# EasyEDA Pro project 2dof-experiment-system.eprj, schematic Schematic3
Create Date: 2025-05-08; Page Name: P1; Project Name: 2dof-experiment-system; Schematic Name: Schematic3; Update Date: 2025-05-08; Company: 嘉立创EDA; Page Size: A4; Version: V1.0
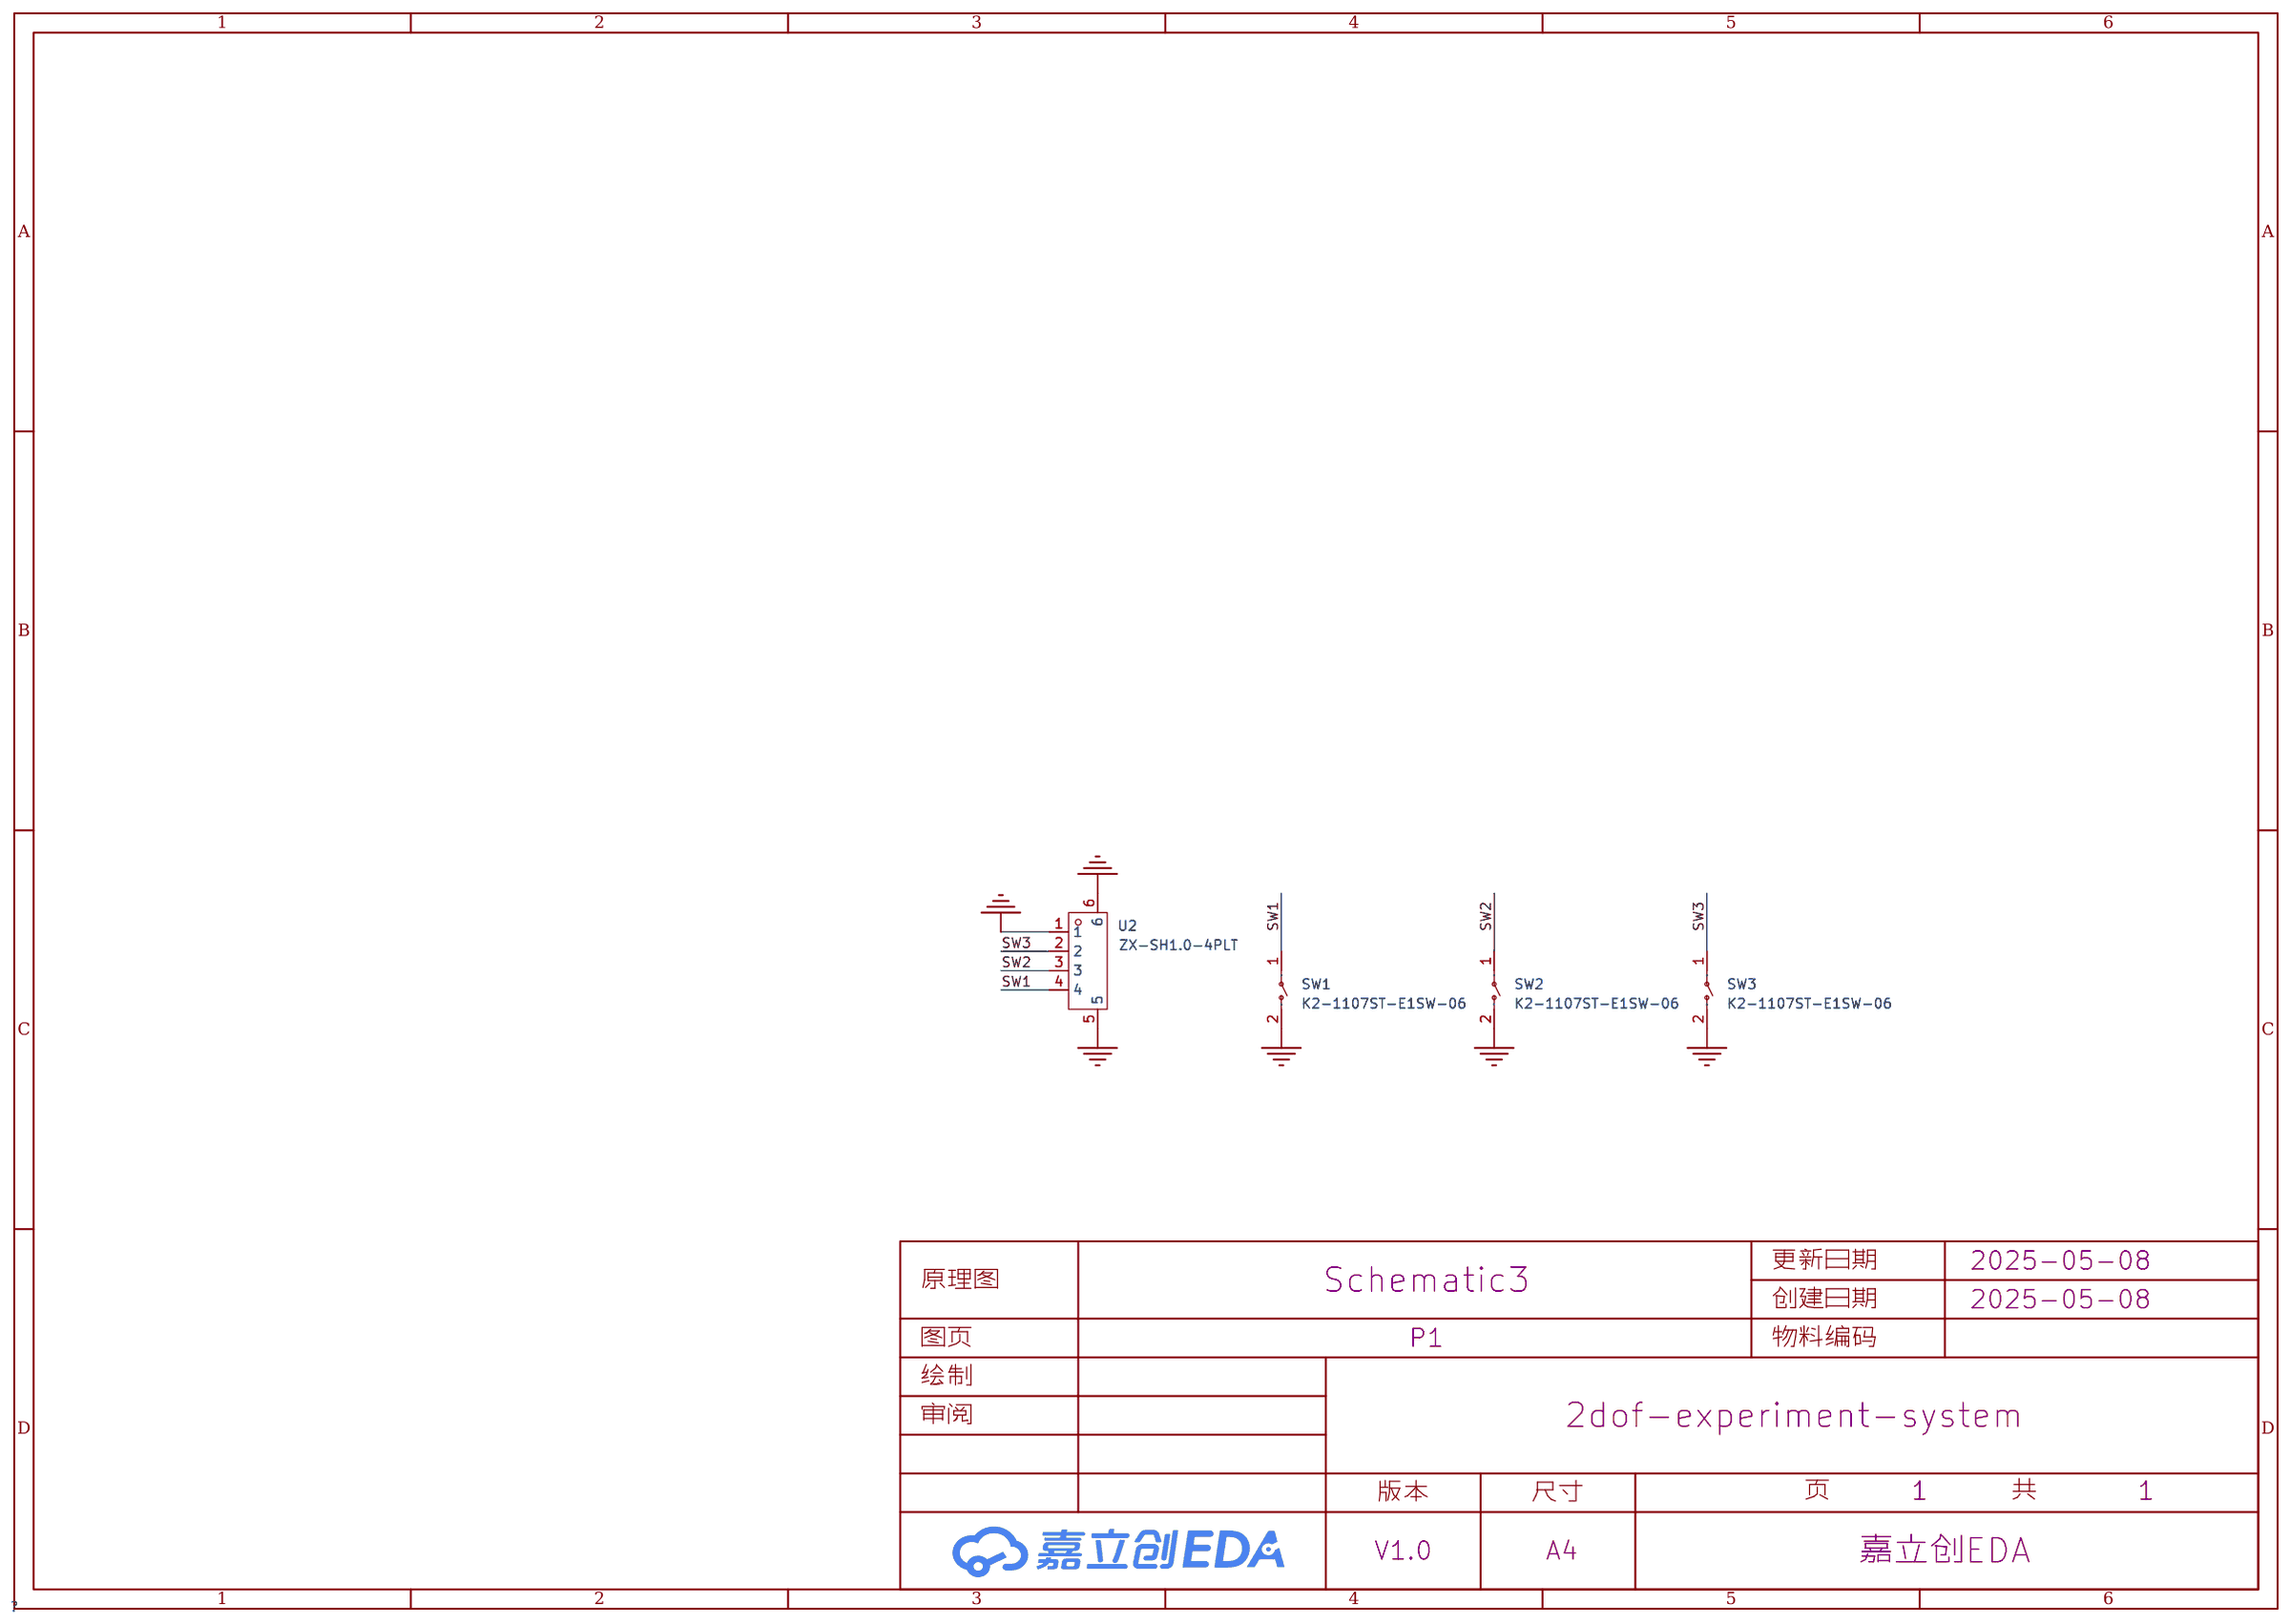
[diagram p2: schematic sheet]

## Parts
SW1  K2-1107ST-E1SW-06  [SW-SMD_L6.0-W3.6-LS8.0]
SW2  K2-1107ST-E1SW-06  [SW-SMD_L6.0-W3.6-LS8.0]
SW3  K2-1107ST-E1SW-06  [SW-SMD_L6.0-W3.6-LS8.0]
U2  ZX-SH1.0-4PLT  [CONN-SMD_4P-P1.00_ZX-SH1.0-4PLN]

## Library data of the parts
SW1-SW3 = K2-1107ST-E1SW-06: 作用力:90gf;安装方式:立贴;开关长度:6.1mm;开关宽度:3.6mm;开关高度:2.5mm;触点电流:50mA;额定电压(DC):12V;绝缘电阻:100MΩ;机械寿命:10万次;; LCSC Part Name: 362.5 进口弹片 有防水膜 灰胶头100G; Supplier Part: C707329; Manufacturer: 韩国韩荣; Supplier Footprint: SMD; JLCPCB Part Class: 扩展库; Datasheet: https://atta.szlcsc.com/upload/public/pdf/source/20210810/381712CEF248770C072B585C3485C888.pdf; Supplier: LCSC; Operating Force: 90gf; Mounting Style: 立贴; Switch Length: 6.1mm; Switch Width: 3.6mm; Switch Height: 2.5mm; Contact Current: 50mA; Voltage Rating (DC): 12V; Insulation Resistance: 100MΩ; Mechanical Life: 10万次; Operating Temperature: -25℃~+85℃
U2 = ZX-SH1.0-4PLT: 插针结构:1x4P;间距:1mm;安装方式:立贴;参考系列:SH;总PIN数:4P;排数:1;每排PIN数:4;行距:-;额定电流:-;触头材质:黄铜;触头镀层:锡;工作温度范围:-;; LCSC Part Name: 1x4P 间距:1mm 立贴 系列:SH; Supplier Part: C7430453; Manufacturer: Megastar(兆星); Supplier Footprint: SMD,P=1mm; JLCPCB Part Class: 扩展库; Datasheet: https://atta.szlcsc.com/upload/public/pdf/source/20230619/835F7171C111E992D22DF3E9A54627DE.pdf; Supplier: LCSC; Pins Structure: 1x4P; Pitch: 1mm; Mounting Style: 立贴; Reference Series: SH; Number of Pins: 4P; Number of Rows: 1; Number of PINs Per Row: 4; Contact Material: 黄铜; Contact Plating: 锡; Supplementary Features: 辅助焊脚; Colour: 米色; Z-Height of the Board: 4.4mm; X-Length of Bottom Edge on Board (Spacing Line): 6.35mm; Y-Width of Bottom Edge on Board: 3.74mm

## Nets
GND: SW1.2 SW2.2 SW3.2 U2.1 U2.5 U2.6
SW1: SW1.1 U2.4
SW2: SW2.1 U2.3
SW3: SW3.1 U2.2
